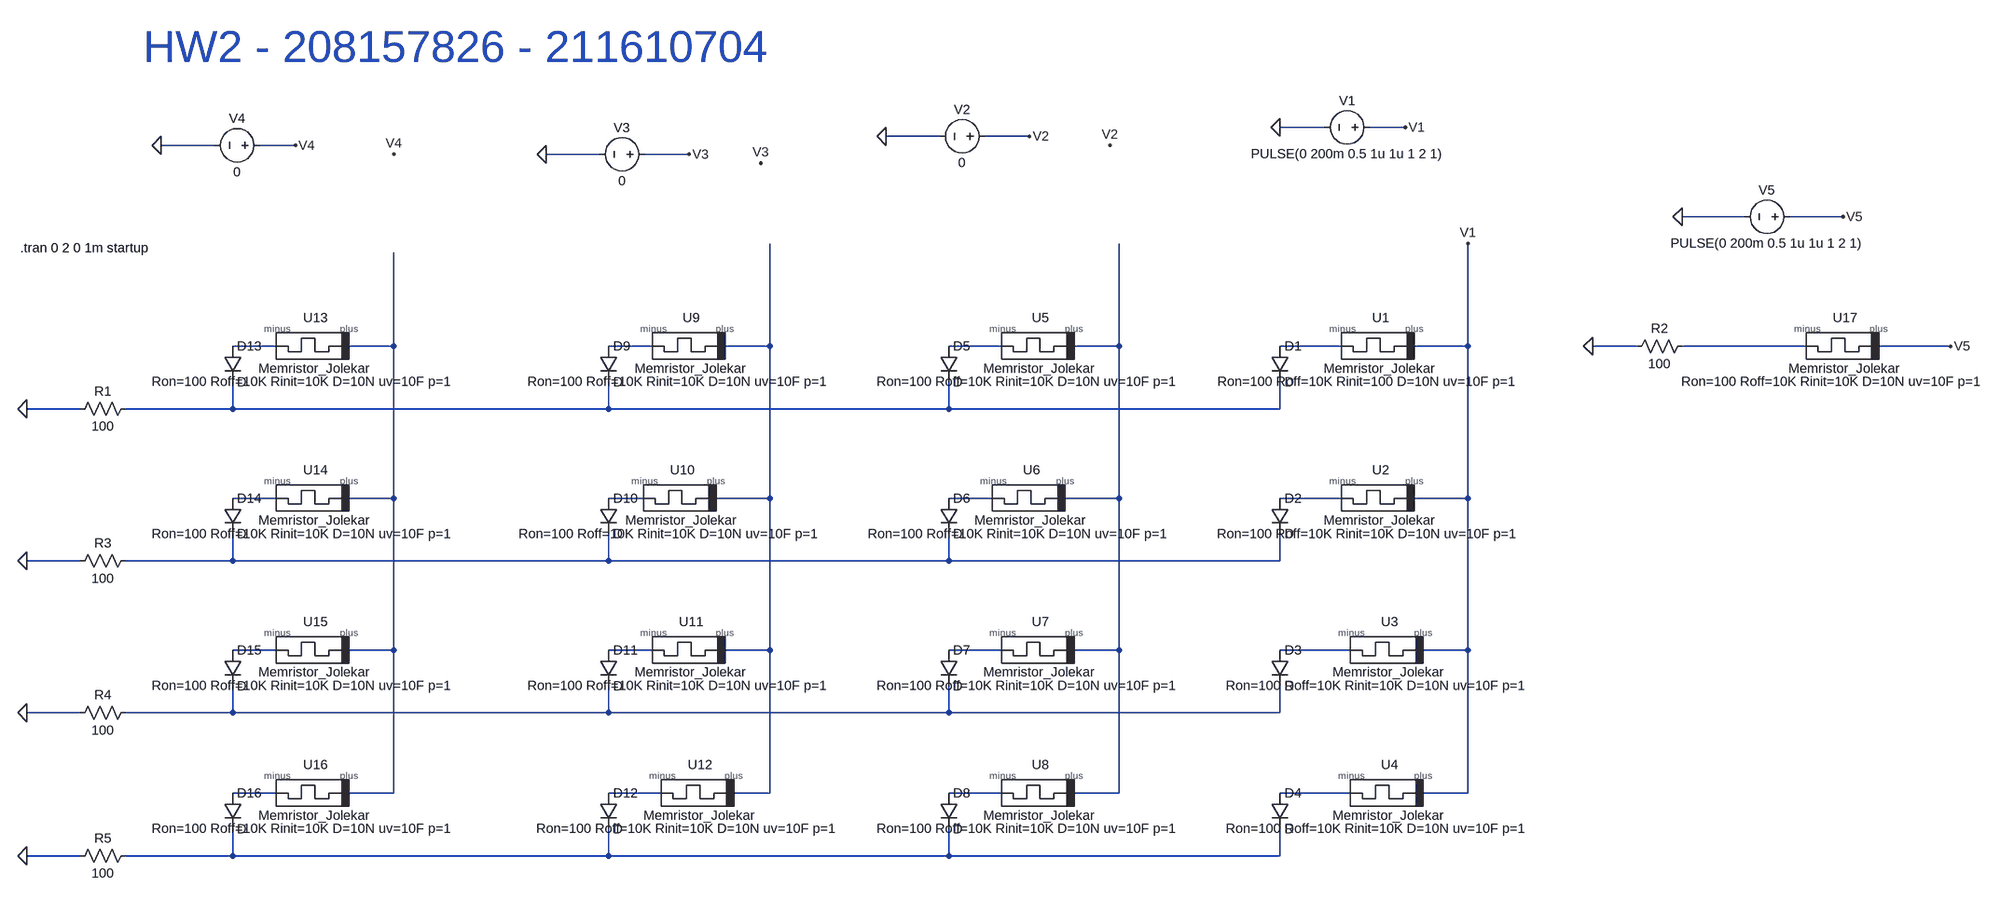
[diagram p0: schematic Q2.asc]
Q2.asc, the LTspice schematic file:
Version 4
SHEET 1 1592 944
WIRE 112 -416 32 -416
WIRE 256 -416 192 -416
WIRE -576 -400 -672 -400
WIRE -416 -400 -496 -400
WIRE -1872 -384 -1968 -384
WIRE -1728 -384 -1792 -384
WIRE -1184 -368 -1280 -368
WIRE -1024 -368 -1104 -368
WIRE 1136 -256 1024 -256
WIRE 1312 -256 1216 -256
WIRE -1760 -16 -1840 -16
WIRE -1552 -16 -1552 -192
WIRE -1552 -16 -1632 -16
WIRE -1088 -16 -1168 -16
WIRE -880 -16 -880 -208
WIRE -880 -16 -960 -16
WIRE -464 -16 -560 -16
WIRE -256 -16 -256 -208
WIRE -256 -16 -336 -16
WIRE 144 -16 32 -16
WIRE 368 -16 368 -208
WIRE 368 -16 272 -16
WIRE 944 -16 864 -16
WIRE 1248 -16 1024 -16
WIRE 1504 -16 1376 -16
WIRE -2112 96 -2208 96
WIRE -1840 96 -1840 48
WIRE -1840 96 -2032 96
WIRE -1168 96 -1168 48
WIRE -1168 96 -1840 96
WIRE -560 96 -560 48
WIRE -560 96 -1168 96
WIRE 32 96 32 48
WIRE 32 96 -560 96
WIRE -1760 256 -1840 256
WIRE -1552 256 -1552 -16
WIRE -1552 256 -1632 256
WIRE -1104 256 -1168 256
WIRE -880 256 -880 -16
WIRE -880 256 -976 256
WIRE -480 256 -560 256
WIRE -256 256 -256 -16
WIRE -256 256 -352 256
WIRE 144 256 32 256
WIRE 368 256 368 -16
WIRE 368 256 272 256
WIRE -2112 368 -2208 368
WIRE -1840 368 -1840 320
WIRE -1840 368 -2032 368
WIRE -1168 368 -1168 320
WIRE -1168 368 -1840 368
WIRE -560 368 -560 320
WIRE -560 368 -1168 368
WIRE 32 368 32 320
WIRE 32 368 -560 368
WIRE -1760 528 -1840 528
WIRE -1552 528 -1552 256
WIRE -1552 528 -1632 528
WIRE -1088 528 -1168 528
WIRE -880 528 -880 256
WIRE -880 528 -960 528
WIRE -464 528 -560 528
WIRE -256 528 -256 256
WIRE -256 528 -336 528
WIRE 160 528 32 528
WIRE 368 528 368 256
WIRE 368 528 288 528
WIRE -2112 640 -2208 640
WIRE -1840 640 -1840 592
WIRE -1840 640 -2032 640
WIRE -1168 640 -1168 592
WIRE -1168 640 -1840 640
WIRE -560 640 -560 592
WIRE -560 640 -1168 640
WIRE 32 640 32 592
WIRE 32 640 -560 640
WIRE -1760 784 -1840 784
WIRE -1552 784 -1552 528
WIRE -1552 784 -1632 784
WIRE -1072 784 -1168 784
WIRE -880 784 -880 528
WIRE -880 784 -944 784
WIRE -464 784 -560 784
WIRE -256 784 -256 528
WIRE -256 784 -336 784
WIRE 160 784 32 784
WIRE 368 784 368 528
WIRE 368 784 288 784
WIRE -2112 896 -2208 896
WIRE -1840 896 -1840 848
WIRE -1840 896 -2032 896
WIRE -1168 896 -1168 848
WIRE -1168 896 -1840 896
WIRE -560 896 -560 848
WIRE -560 896 -1168 896
WIRE 32 896 32 848
WIRE 32 896 -560 896
FLAG 368 -208 V1
FLAG -272 -384 V2
FLAG -896 -352 V3
FLAG -1552 -368 V4
FLAG 32 -416 0
FLAG 256 -416 V1
FLAG -1968 -384 0
FLAG -1280 -368 0
FLAG -672 -400 0
FLAG -416 -400 V2
FLAG -1024 -368 V3
FLAG -1728 -384 V4
FLAG -2208 96 0
FLAG -2208 368 0
FLAG -2208 640 0
FLAG -2208 896 0
FLAG 864 -16 0
FLAG 1504 -16 V5
FLAG 1024 -256 0
FLAG 1312 -256 V5
SYMBOL Jolekar 208 -16 M0
SYMATTR InstName U1
SYMATTR SpiceLine Ron=100 Roff=10K Rinit=100 D=10N uv=10F p=1
SYMBOL Jolekar 208 256 M0
SYMATTR InstName U2
SYMATTR SpiceLine Ron=100 Roff=10K Rinit=10K D=10N uv=10F p=1
SYMBOL Jolekar 224 528 M0
SYMATTR InstName U3
SYMATTR SpiceLine Ron=100 Roff=10K Rinit=10K D=10N uv=10F p=1
SYMBOL Jolekar 224 784 M0
SYMATTR InstName U4
SYMATTR SpiceLine Ron=100 Roff=10K Rinit=10K D=10N uv=10F p=1
SYMBOL Jolekar -400 -16 M0
SYMATTR InstName U5
SYMATTR SpiceLine Ron=100 Roff=10K Rinit=10K D=10N uv=10F p=1
SYMBOL Jolekar -416 256 M0
SYMATTR InstName U6
SYMATTR SpiceLine Ron=100 Roff=10K Rinit=10K D=10N uv=10F p=1
SYMBOL Jolekar -400 528 M0
SYMATTR InstName U7
SYMATTR SpiceLine Ron=100 Roff=10K Rinit=10K D=10N uv=10F p=1
SYMBOL Jolekar -400 784 M0
SYMATTR InstName U8
SYMATTR SpiceLine Ron=100 Roff=10K Rinit=10K D=10N uv=10F p=1
SYMBOL Jolekar -1024 -16 M0
SYMATTR InstName U9
SYMATTR SpiceLine Ron=100 Roff=10K Rinit=10K D=10N uv=10F p=1
SYMBOL Jolekar -1040 256 M0
SYMATTR InstName U10
SYMATTR SpiceLine Ron=100 Roff=10K Rinit=10K D=10N uv=10F p=1
SYMBOL Jolekar -1024 528 M0
SYMATTR InstName U11
SYMATTR SpiceLine Ron=100 Roff=10K Rinit=10K D=10N uv=10F p=1
SYMBOL Jolekar -1008 784 M0
SYMATTR InstName U12
SYMATTR SpiceLine Ron=100 Roff=10K Rinit=10K D=10N uv=10F p=1
SYMBOL Jolekar -1696 -16 M0
SYMATTR InstName U13
SYMATTR SpiceLine Ron=100 Roff=10K Rinit=10K D=10N uv=10F p=1
SYMBOL Jolekar -1696 256 M0
SYMATTR InstName U14
SYMATTR SpiceLine Ron=100 Roff=10K Rinit=10K D=10N uv=10F p=1
SYMBOL Jolekar -1696 528 M0
SYMATTR InstName U15
SYMATTR SpiceLine Ron=100 Roff=10K Rinit=10K D=10N uv=10F p=1
SYMBOL Jolekar -1696 784 M0
SYMATTR InstName U16
SYMATTR SpiceLine Ron=100 Roff=10K Rinit=10K D=10N uv=10F p=1
SYMBOL voltage 208 -416 R90
WINDOW 0 -32 56 VBottom 2
WINDOW 3 32 56 VTop 2
WINDOW 123 0 0 Left 0
WINDOW 39 0 0 Left 0
SYMATTR InstName V1
SYMATTR Value PULSE(0 200m 0.5 1u 1u 1 2 1)
SYMBOL voltage -480 -400 R90
WINDOW 0 -32 56 VBottom 2
WINDOW 3 32 56 VTop 2
WINDOW 123 0 0 Left 0
WINDOW 39 0 0 Left 0
SYMATTR InstName V2
SYMATTR Value 0
SYMBOL voltage -1088 -368 R90
WINDOW 0 -32 56 VBottom 2
WINDOW 3 32 56 VTop 2
WINDOW 123 0 0 Left 0
WINDOW 39 0 0 Left 0
SYMATTR InstName V3
SYMATTR Value 0
SYMBOL voltage -1776 -384 R90
WINDOW 0 -32 56 VBottom 2
WINDOW 3 32 56 VTop 2
WINDOW 123 0 0 Left 0
WINDOW 39 0 0 Left 0
SYMATTR InstName V4
SYMATTR Value 0
SYMBOL res -2016 80 R90
WINDOW 0 0 56 VBottom 2
WINDOW 3 32 56 VTop 2
SYMATTR InstName R1
SYMATTR Value 100
SYMBOL Jolekar 1312 -16 M0
SYMATTR InstName U17
SYMATTR SpiceLine Ron=100 Roff=10K Rinit=10K D=10N uv=10F p=1
SYMBOL res 1040 -32 R90
WINDOW 0 0 56 VBottom 2
WINDOW 3 32 56 VTop 2
SYMATTR InstName R2
SYMATTR Value 100
SYMBOL voltage 1232 -256 R90
WINDOW 0 -32 56 VBottom 2
WINDOW 3 32 56 VTop 2
WINDOW 123 0 0 Left 0
WINDOW 39 0 0 Left 0
SYMATTR InstName V5
SYMATTR Value PULSE(0 200m 0.5 1u 1u 1 2 1)
SYMBOL res -2016 352 R90
WINDOW 0 0 56 VBottom 2
WINDOW 3 32 56 VTop 2
SYMATTR InstName R3
SYMATTR Value 100
SYMBOL res -2016 624 R90
WINDOW 0 0 56 VBottom 2
WINDOW 3 32 56 VTop 2
SYMATTR InstName R4
SYMATTR Value 100
SYMBOL res -2016 880 R90
WINDOW 0 0 56 VBottom 2
WINDOW 3 32 56 VTop 2
SYMATTR InstName R5
SYMATTR Value 100
SYMBOL diode 16 -16 R0
SYMATTR InstName D1
SYMBOL diode 16 256 R0
SYMATTR InstName D2
SYMBOL diode 16 528 R0
SYMATTR InstName D3
SYMBOL diode 16 784 R0
SYMATTR InstName D4
SYMBOL diode -576 -16 R0
SYMATTR InstName D5
SYMBOL diode -576 256 R0
SYMATTR InstName D6
SYMBOL diode -576 528 R0
SYMATTR InstName D7
SYMBOL diode -576 784 R0
SYMATTR InstName D8
SYMBOL diode -1184 -16 R0
SYMATTR InstName D9
SYMBOL diode -1184 256 R0
SYMATTR InstName D10
SYMBOL diode -1184 528 R0
SYMATTR InstName D11
SYMBOL diode -1184 784 R0
SYMATTR InstName D12
SYMBOL diode -1856 -16 R0
SYMATTR InstName D13
SYMBOL diode -1856 256 R0
SYMATTR InstName D14
SYMBOL diode -1856 528 R0
SYMATTR InstName D15
SYMBOL diode -1856 784 R0
SYMATTR InstName D16
TEXT -2000 -560 Left 6 ;HW2 - 208157826 - 211610704
TEXT -2220 -200 Left 2 !.tran 0 2 0 1m startup

The netlist it stands for:
* Q2.asc
XU1 V1 N007 Memristor_Jolekar Ron=100 Roff=10K Rinit=100 D=10N uv=10F p=1  ; pins plus minus
XU2 V1 N013 Memristor_Jolekar Ron=100 Roff=10K Rinit=10K D=10N uv=10F p=1  ; pins plus minus
XU3 V1 N018 Memristor_Jolekar Ron=100 Roff=10K Rinit=10K D=10N uv=10F p=1  ; pins plus minus
XU4 V1 N023 Memristor_Jolekar Ron=100 Roff=10K Rinit=10K D=10N uv=10F p=1  ; pins plus minus
XU5 N006 N005 Memristor_Jolekar Ron=100 Roff=10K Rinit=10K D=10N uv=10F p=1  ; pins plus minus
XU6 N006 N012 Memristor_Jolekar Ron=100 Roff=10K Rinit=10K D=10N uv=10F p=1  ; pins plus minus
XU7 N006 N017 Memristor_Jolekar Ron=100 Roff=10K Rinit=10K D=10N uv=10F p=1  ; pins plus minus
XU8 N006 N022 Memristor_Jolekar Ron=100 Roff=10K Rinit=10K D=10N uv=10F p=1  ; pins plus minus
XU9 N004 N003 Memristor_Jolekar Ron=100 Roff=10K Rinit=10K D=10N uv=10F p=1  ; pins plus minus
XU10 N004 N011 Memristor_Jolekar Ron=100 Roff=10K Rinit=10K D=10N uv=10F p=1  ; pins plus minus
XU11 N004 N016 Memristor_Jolekar Ron=100 Roff=10K Rinit=10K D=10N uv=10F p=1  ; pins plus minus
XU12 N004 N021 Memristor_Jolekar Ron=100 Roff=10K Rinit=10K D=10N uv=10F p=1  ; pins plus minus
XU13 N002 N001 Memristor_Jolekar Ron=100 Roff=10K Rinit=10K D=10N uv=10F p=1  ; pins plus minus
XU14 N002 N010 Memristor_Jolekar Ron=100 Roff=10K Rinit=10K D=10N uv=10F p=1  ; pins plus minus
XU15 N002 N015 Memristor_Jolekar Ron=100 Roff=10K Rinit=10K D=10N uv=10F p=1  ; pins plus minus
XU16 N002 N020 Memristor_Jolekar Ron=100 Roff=10K Rinit=10K D=10N uv=10F p=1  ; pins plus minus
V1 V1 0 PULSE(0 200m 0.5 1u 1u 1 2 1)
V2 V2 0 0
V3 V3 0 0
V4 V4 0 0
R1 N009 0 100
XU17 V5 N008 Memristor_Jolekar Ron=100 Roff=10K Rinit=10K D=10N uv=10F p=1  ; pins plus minus
R2 N008 0 100
V5 V5 0 PULSE(0 200m 0.5 1u 1u 1 2 1)
R3 N014 0 100
R4 N019 0 100
R5 N024 0 100
D1 N007 N009 D
D2 N013 N014 D
D3 N018 N019 D
D4 N023 N024 D
D5 N005 N009 D
D6 N012 N014 D
D7 N017 N019 D
D8 N022 N024 D
D9 N003 N009 D
D10 N011 N014 D
D11 N016 N019 D
D12 N021 N024 D
D13 N001 N009 D
D14 N010 N014 D
D15 N015 N019 D
D16 N020 N024 D
.model D D
.lib standard.dio
* HW2 - 208157826 - 211610704
.tran 0 2 0 1m startup
.lib Jolekar.lib
.backanno
.end